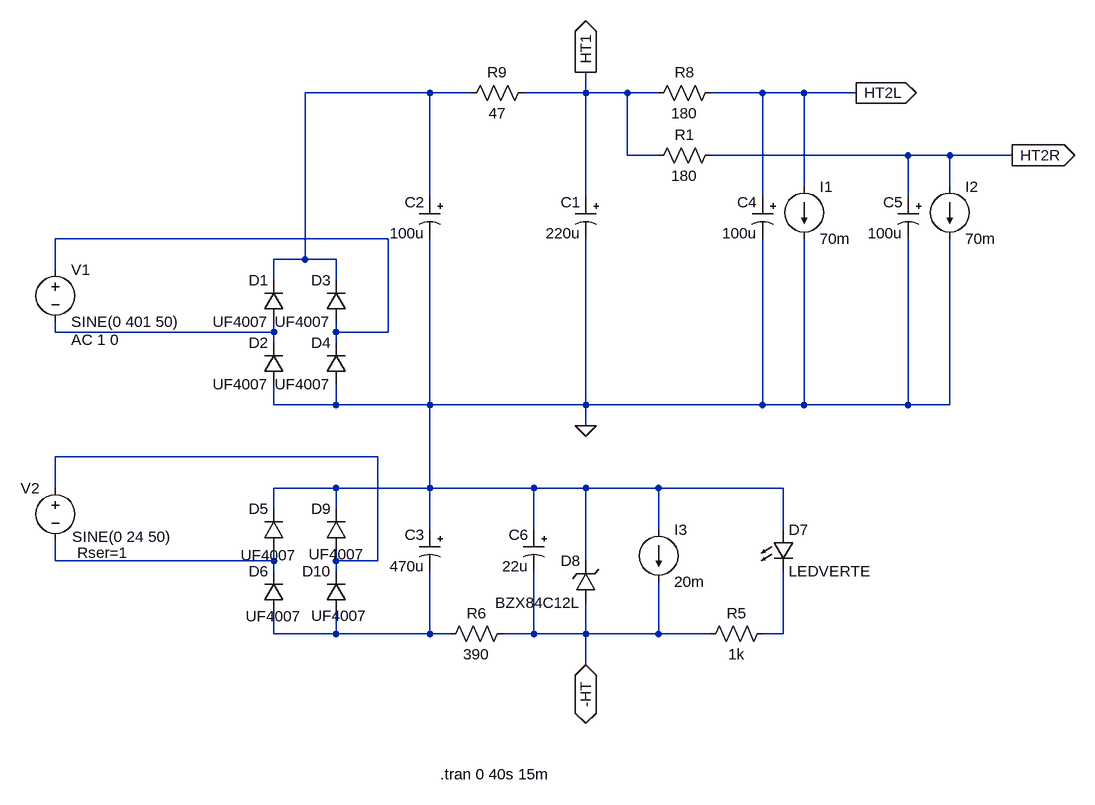
[diagram p0: schematic alim_Tof_rev2.asc]
alim_Tof_rev2.asc, the LTspice schematic file:
Version 4
SHEET 1 2136 972
WIRE 16 -272 -176 -272
WIRE 80 -272 16 -272
WIRE 256 -272 256 -304
WIRE 256 -272 160 -272
WIRE 320 -272 256 -272
WIRE 368 -272 320 -272
WIRE 528 -272 448 -272
WIRE 592 -272 528 -272
WIRE 672 -272 592 -272
WIRE 320 -176 320 -272
WIRE 368 -176 320 -176
WIRE 752 -176 448 -176
WIRE 816 -176 752 -176
WIRE 912 -176 816 -176
WIRE 592 -128 592 -272
WIRE 816 -128 816 -176
WIRE 16 -112 16 -272
WIRE 256 -112 256 -272
WIRE 528 -112 528 -272
WIRE 752 -112 752 -176
WIRE -48 -48 -560 -48
WIRE -176 -16 -176 -272
WIRE -176 -16 -224 -16
WIRE -128 -16 -176 -16
WIRE -560 0 -560 -48
WIRE -224 16 -224 -16
WIRE -128 16 -128 -16
WIRE -560 96 -560 80
WIRE -224 96 -224 80
WIRE -224 96 -560 96
WIRE -128 96 -128 80
WIRE -48 96 -48 -48
WIRE -48 96 -128 96
WIRE -224 112 -224 96
WIRE -128 112 -128 96
WIRE -224 208 -224 176
WIRE -128 208 -128 176
WIRE -128 208 -224 208
WIRE 16 208 16 -48
WIRE 16 208 -128 208
WIRE 256 208 256 -48
WIRE 256 208 16 208
WIRE 528 208 528 -48
WIRE 528 208 256 208
WIRE 592 208 592 -48
WIRE 592 208 528 208
WIRE 752 208 752 -48
WIRE 752 208 592 208
WIRE 816 208 816 -48
WIRE 816 208 752 208
WIRE 256 240 256 208
WIRE -64 288 -560 288
WIRE -560 336 -560 288
WIRE -128 336 -224 336
WIRE 16 336 16 208
WIRE 16 336 -128 336
WIRE 176 336 16 336
WIRE 256 336 176 336
WIRE 368 336 256 336
WIRE 560 336 368 336
WIRE -224 368 -224 336
WIRE -128 368 -128 336
WIRE 16 400 16 336
WIRE 176 400 176 336
WIRE 368 400 368 336
WIRE 560 400 560 336
WIRE -560 448 -560 416
WIRE -224 448 -224 432
WIRE -224 448 -560 448
WIRE -128 448 -128 432
WIRE -64 448 -64 288
WIRE -64 448 -128 448
WIRE 256 448 256 336
WIRE -224 464 -224 448
WIRE -128 464 -128 448
WIRE -224 560 -224 528
WIRE -128 560 -128 528
WIRE -128 560 -224 560
WIRE 16 560 16 464
WIRE 16 560 -128 560
WIRE 48 560 16 560
WIRE 176 560 176 464
WIRE 176 560 128 560
WIRE 256 560 256 512
WIRE 256 560 176 560
WIRE 368 560 368 480
WIRE 368 560 256 560
WIRE 448 560 368 560
WIRE 560 560 560 464
WIRE 560 560 528 560
WIRE 256 608 256 560
FLAG 256 608 -HT
IOPIN 256 608 BiDir
FLAG 256 -304 HT1
IOPIN 256 -304 Out
FLAG 672 -272 HT2L
IOPIN 672 -272 Out
FLAG 912 -176 HT2R
IOPIN 912 -176 Out
FLAG 256 240 0
SYMBOL diode -208 80 R180
WINDOW 0 24 64 Left 2
WINDOW 3 24 0 Left 2
SYMATTR InstName D1
SYMATTR Value UF4007
SYMBOL diode -208 176 R180
WINDOW 0 24 64 Left 2
WINDOW 3 24 0 Left 2
SYMATTR InstName D2
SYMATTR Value UF4007
SYMBOL diode -112 80 R180
WINDOW 0 24 64 Left 2
WINDOW 3 24 0 Left 2
SYMATTR InstName D3
SYMATTR Value UF4007
SYMBOL diode -112 176 R180
WINDOW 0 24 64 Left 2
WINDOW 3 24 0 Left 2
SYMATTR InstName D4
SYMATTR Value UF4007
SYMBOL voltage -560 320 M0
WINDOW 123 0 0 Left 2
WINDOW 39 -112 115 Left 2
WINDOW 3 -179 91 Left 2
SYMATTR SpiceLine Rser=1
SYMATTR Value SINE(0 24 50)
SYMATTR InstName V2
SYMBOL res 144 544 R90
WINDOW 0 0 56 VBottom 2
WINDOW 3 32 56 VTop 2
SYMATTR InstName R6
SYMATTR Value 390
SYMBOL zener 272 512 R180
WINDOW 0 24 64 Left 2
WINDOW 3 24 0 Left 2
SYMATTR InstName D8
SYMATTR Value BZX84C12L
SYMATTR Description Diode
SYMATTR Type diode
SYMBOL res 544 544 R90
WINDOW 0 0 56 VBottom 2
WINDOW 3 32 56 VTop 2
SYMATTR InstName R5
SYMATTR Value 1k
SYMBOL LED 544 400 R0
SYMATTR InstName D7
SYMATTR Value LEDVERTE
SYMATTR Description Diode
SYMATTR Type diode
SYMBOL voltage -560 -16 R0
WINDOW 123 24 124 Left 2
WINDOW 39 0 0 Left 2
SYMATTR Value2 AC 1 0
SYMATTR InstName V1
SYMATTR Value SINE(0 401 50)
SYMBOL res 464 -288 R90
WINDOW 0 0 56 VBottom 2
WINDOW 3 32 56 VTop 2
SYMATTR InstName R8
SYMATTR Value 180
SYMBOL polcap 272 -112 M0
WINDOW 3 24 56 Left 2
SYMATTR Value 220u
SYMATTR InstName C1
SYMATTR SpiceLine V=100 Irms=590m Rser=0.1 Lser=0 Rpar=2Meg mfg="Nichicon" pn="UPR2A221MRH" type="Al electrolytic"
SYMATTR Description Capacitor
SYMATTR Type cap
SYMBOL res 176 -288 R90
WINDOW 0 0 56 VBottom 2
WINDOW 3 32 56 VTop 2
SYMATTR InstName R9
SYMATTR Value 47
SYMBOL polcap 32 -112 M0
WINDOW 3 24 56 Left 2
SYMATTR Value 100u
SYMATTR InstName C2
SYMATTR SpiceLine V=100 Irms=385m Rser=0.18 Lser=0 Rpar=2Meg mfg="Nichicon" pn="UPR2A101MRH" type="Al electrolytic"
SYMATTR Description Capacitor
SYMATTR Type cap
SYMBOL res 464 -192 R90
WINDOW 0 0 56 VBottom 2
WINDOW 3 32 56 VTop 2
SYMATTR InstName R1
SYMATTR Value 180
SYMBOL polcap 544 -112 M0
WINDOW 3 24 56 Left 2
SYMATTR Value 100u
SYMATTR InstName C4
SYMATTR SpiceLine V=100 Irms=385m Rser=0.18 Lser=0 Rpar=2Meg mfg="Nichicon" pn="UPR2A101MRH" type="Al electrolytic"
SYMATTR Description Capacitor
SYMATTR Type cap
SYMBOL polcap 768 -112 M0
WINDOW 3 24 56 Left 2
SYMATTR Value 100u
SYMATTR InstName C5
SYMATTR SpiceLine V=100 Irms=385m Rser=0.18 Lser=0 Rpar=2Meg mfg="Nichicon" pn="UPR2A101MRH" type="Al electrolytic"
SYMATTR Description Capacitor
SYMATTR Type cap
SYMBOL current 592 -128 R0
WINDOW 123 0 0 Left 2
WINDOW 39 0 0 Left 2
SYMATTR InstName I1
SYMATTR Value 70m
SYMBOL current 816 -128 R0
WINDOW 123 0 0 Left 2
WINDOW 39 0 0 Left 2
SYMATTR InstName I2
SYMATTR Value 70m
SYMBOL diode -208 432 R180
WINDOW 0 24 64 Left 2
WINDOW 3 -19 -7 Left 2
SYMATTR InstName D5
SYMATTR Value UF4007
SYMBOL diode -208 528 R180
WINDOW 0 24 64 Left 2
WINDOW 3 -27 -5 Left 2
SYMATTR InstName D6
SYMATTR Value UF4007
SYMBOL diode -112 432 R180
WINDOW 0 24 64 Left 2
WINDOW 3 -28 -6 Left 2
SYMATTR InstName D9
SYMATTR Value UF4007
SYMBOL diode -112 528 R180
WINDOW 0 24 64 Left 2
WINDOW 3 -32 -4 Left 2
SYMATTR InstName D10
SYMATTR Value UF4007
SYMBOL polcap 192 400 M0
WINDOW 3 24 56 Left 2
SYMATTR Value 22u
SYMATTR InstName C6
SYMATTR SpiceLine V=63 Irms=240m Rser=1 Lser=0 Rpar=2Meg mfg="Panasonic" pn="ECA1JFQ220" type="Al electrolytic"
SYMATTR Description Capacitor
SYMATTR Type cap
SYMBOL polcap 32 400 M0
WINDOW 3 24 56 Left 2
SYMATTR Value 470u
SYMATTR InstName C3
SYMATTR SpiceLine V=50 Irms=1.47 Rser=0.07 Lser=0 Rpar=2Meg mfg="Panasonic" pn="ECA1HFQ471S" type="Al electrolytic"
SYMATTR Description Capacitor
SYMATTR Type cap
SYMBOL current 368 400 R0
WINDOW 123 0 0 Left 2
WINDOW 39 0 0 Left 2
SYMATTR InstName I3
SYMATTR Value 20m
TEXT 32 776 Left 2 !.tran 0 40s 15m

The netlist it stands for:
* alim_Tof_rev2.asc
D1 N003 N001 UF4007
D2 0 N003 UF4007
D3 N002 N001 UF4007
D4 0 N002 UF4007
V2 N004 N005 SINE(0 24 50) Rser=1
R6 -HT N006 390
D8 -HT 0 BZX84C12L
R5 N007 -HT 1k
D7 0 N007 LEDVERTE
V1 N002 N003 SINE(0 401 50) AC 1 0
R8 HT2L HT1 180
C1 HT1 0 220u V=100 Irms=590m Rser=0.1 Lser=0 Rpar=2Meg mfg="Nichicon" pn="UPR2A221MRH" type="Al electrolytic"
R9 HT1 N001 47
C2 N001 0 100u V=100 Irms=385m Rser=0.18 Lser=0 Rpar=2Meg mfg="Nichicon" pn="UPR2A101MRH" type="Al electrolytic"
R1 HT2R HT1 180
C4 HT2L 0 100u V=100 Irms=385m Rser=0.18 Lser=0 Rpar=2Meg mfg="Nichicon" pn="UPR2A101MRH" type="Al electrolytic"
C5 HT2R 0 100u V=100 Irms=385m Rser=0.18 Lser=0 Rpar=2Meg mfg="Nichicon" pn="UPR2A101MRH" type="Al electrolytic"
I1 HT2L 0 70m
I2 HT2R 0 70m
D5 N005 0 UF4007
D6 N006 N005 UF4007
D9 N004 0 UF4007
D10 N006 N004 UF4007
C6 0 -HT 22u V=63 Irms=240m Rser=1 Lser=0 Rpar=2Meg mfg="Panasonic" pn="ECA1JFQ220" type="Al electrolytic"
C3 0 N006 470u V=50 Irms=1.47 Rser=0.07 Lser=0 Rpar=2Meg mfg="Panasonic" pn="ECA1HFQ471S" type="Al electrolytic"
I3 0 -HT 20m
.model D D
.lib standard.dio
.tran 0 40s 15m
.backanno
.end